# EAGLE schematic torqueControllerPWM (EAGLE 9.4.1)
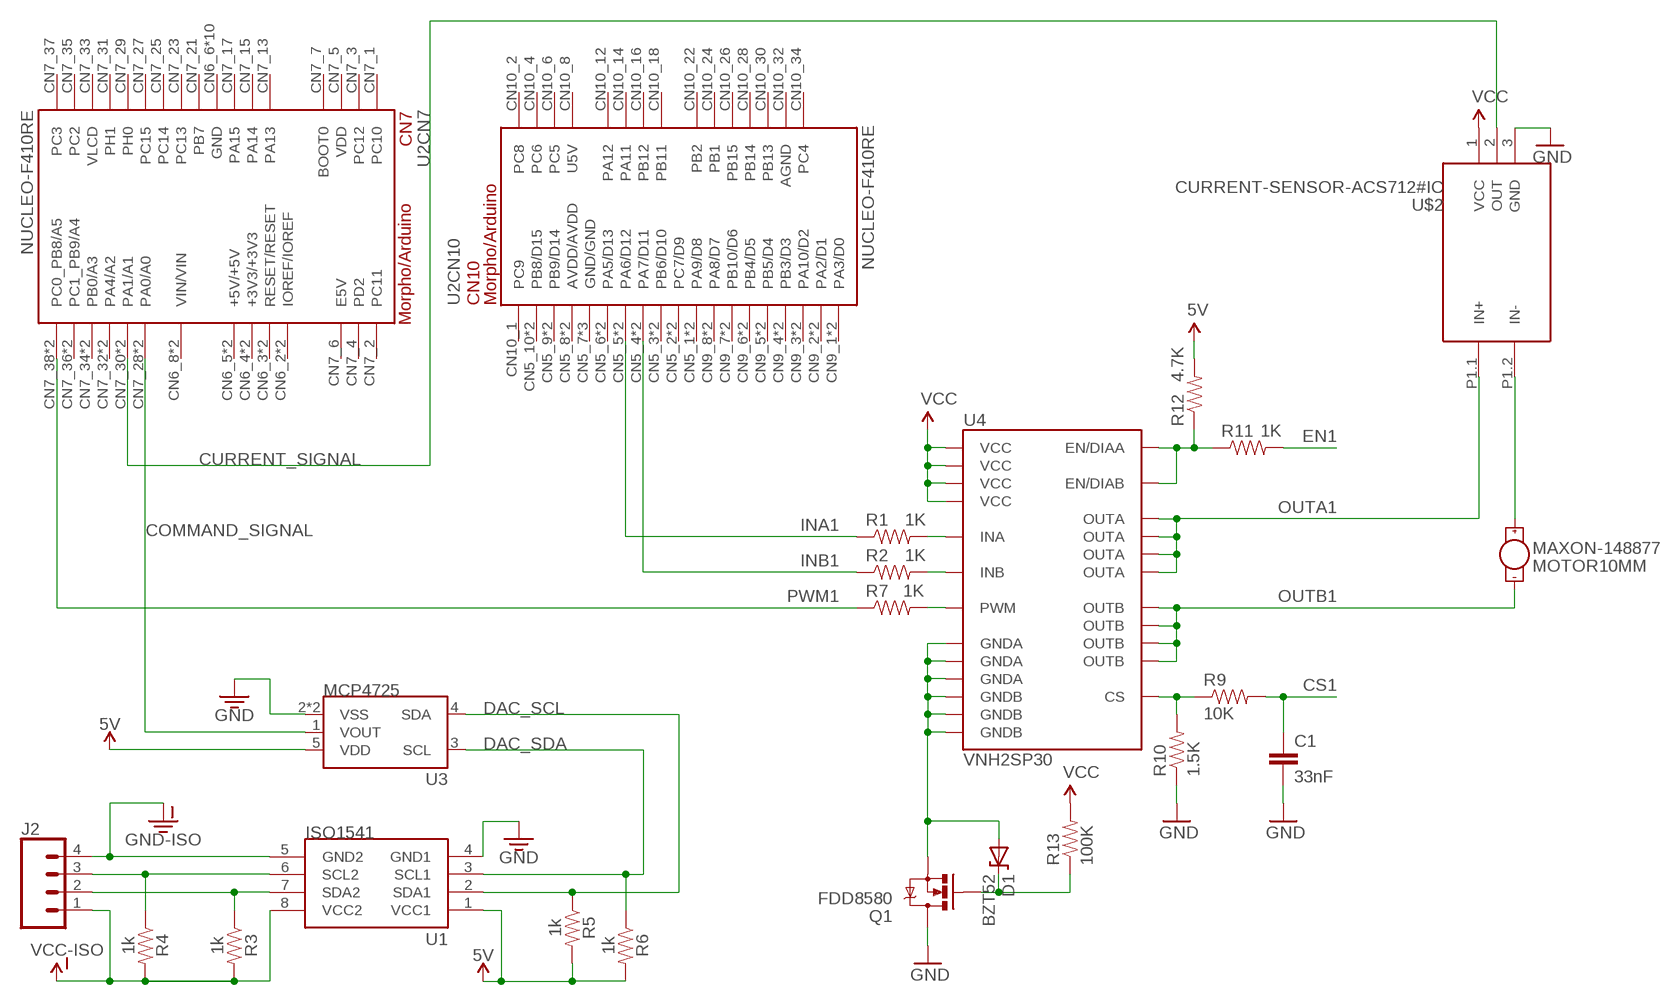
[diagram p0: schematic, sheet 1]

## Parts
C1  33nF  CAP0402-CAP  [0402-CAP]
D1  BZT52  DIODE-ZENER-BZT52  [SOD-323]
J2  CONN_04LONGPADS  [1X04_LONGPADS]
MAXON-148877  MOTOR10MM  [VIBE-MOTOR-10MM]
Q1  FDD8580  MOSFET-NCHANNELFDD8580  [DPAK]
R1  1K  RESISTOR0402-RES  [0402-RES]
R2  1K  RESISTOR0402-RES  [0402-RES]
R3  1k  RESISTOR1206  [1206]
R4  1k  RESISTOR1206  [1206]
R5  1k  RESISTOR1206  [1206]
R6  1k  RESISTOR1206  [1206]
R7  1K  RESISTOR0402-RES  [0402-RES]
R9  10K  RESISTOR0402-RES  [0402-RES]
R10  1.5K  RESISTOR0402-RES  [0402-RES]
R11  1K  RESISTOR0402-RES  [0402-RES]
R12  4.7K  RESISTOR0402-RES  [0402-RES]
R13  100K  RESISTOR0402-RES  [0402-RES]
U1  ISO1541  [DIP254P762X508-8]
U2  NUCLEO-F410RE  [MODULE_NUCLEO-L053R8]
U3  MCP4725  [1X06_LONGPADS]
U4  VNH2SP30  [VNH2SP30]
U$2  CURRENT-SENSOR-ACS712#IC  [CURRENT-SENSOR-ACS712#IC]

## Nets
3.3V: U3.2(VSS) U3.6(VSS) ; supply symbol labelled GND
5V: R5.2 R6.2 R12.2 U1.1(VCC1) U3.5(VDD)
COMMAND_SIGNAL: U2.CN7_28(CN7:PA0/A0) U2.CN8_1(CN7:PA0/A0) U3.1(VOUT)
CS1: C1.1 R9.2
CURRENT_SIGNAL: U2.CN7_30(CN7:PA1/A1) U2.CN8_2(CN7:PA1/A1) U$2.2(OUT)
DAC_SCL: R6.1 U1.3(SCL1) U3.3(SCL)
DAC_SDA: R5.1 U1.2(SDA1) U3.4(SDA)
EN1: R11.2
GND: C1.2 Q1.4(D) R10.1 U1.4(GND1) U$2.3(GND)
GND-ISO: J2.4 U1.5(GND2)
INA1: R1.1 U2.CN5_5(CN10:PA6/D12) U2.CN10_13(CN10:PA6/D12)
INB1: R2.1 U2.CN5_4(CN10:PA7/D11) U2.CN10_15(CN10:PA7/D11)
N$1: R2.2 U4.11(INB)
N$2: R1.2 U4.5(INA)
N$3: J2.2 R3.1 U1.7(SDA2)
N$4: J2.3 R4.1 U1.6(SCL2)
N$5: R7.2 U4.8(PWM)
N$7: R9.1 R10.2 U4.9(CS)
N$8: MAXON-148877.+ U$2.P1.2(IN-)
N$10: D1.2(A) Q1.3(S) U4.18(GNDB) U4.19(GNDB) U4.20(GNDB) U4.26(GNDA) U4.27(GNDA) U4.28(GNDA)
N$12: R11.1 R12.1 U4.6(EN/DIAA) U4.10(EN/DIAB)
N$13: D1.1(C) Q1.1(G) R13.1
OUTA1: U4.1(OUTA) U4.25(OUTA) U4.30(OUTA) U4.SLUG3(OUTA) U$2.P1.1(IN+)
OUTB1: MAXON-148877.- U4.15(OUTB) U4.16(OUTB) U4.21(OUTB) U4.SLUG2(OUTB)
PWM1: R7.1 U2.CN7_38(CN7:PC0_PB8/A5) U2.CN8_6(CN7:PC0_PB8/A5)
VCC: R13.2 U4.3(VCC) U4.13(VCC) U4.23(VCC) U4.SLUG1(VCC) U$2.1(VCC)
VCC-ISO: J2.1 R3.2 R4.2 U1.8(VCC2)
Unconnected: U2.CN5_1(CN10:PA9/D8) U2.CN5_2(CN10:PC7/D9) U2.CN5_3(CN10:PB6/D10) U2.CN5_6(CN10:PA5/D13) U2.CN5_7(CN10:GND/GND) U2.CN5_8(CN10:AVDD/AVDD) U2.CN5_9(CN10:PB9/D14) U2.CN5_10(CN10:PB8/D15) U2.CN6_2(CN7:IOREF/IOREF) U2.CN6_3(CN7:RESET/RESET) U2.CN6_4(CN7:+3V3/+3V3) U2.CN6_5(CN7:+5V/+5V) U2.CN6_6(CN7:GND) U2.CN6_7(CN7:GND) U2.CN6_8(CN7:VIN/VIN) U2.CN7_1(CN7:PC10) U2.CN7_2(CN7:PC11) U2.CN7_3(CN7:PC12) U2.CN7_4(CN7:PD2) U2.CN7_5(CN7:VDD) U2.CN7_6(CN7:E5V) U2.CN7_7(CN7:BOOT0) U2.CN7_8(CN7:GND) U2.CN7_12(CN7:IOREF/IOREF) U2.CN7_13(CN7:PA13) U2.CN7_14(CN7:RESET/RESET) U2.CN7_15(CN7:PA14) U2.CN7_16(CN7:+3V3/+3V3) U2.CN7_17(CN7:PA15) U2.CN7_18(CN7:+5V/+5V) U2.CN7_19(CN7:GND) U2.CN7_20(CN7:GND) U2.CN7_21(CN7:PB7) U2.CN7_22(CN7:GND) U2.CN7_23(CN7:PC13) U2.CN7_24(CN7:VIN/VIN) U2.CN7_25(CN7:PC14) U2.CN7_27(CN7:PC15) U2.CN7_29(CN7:PH0) U2.CN7_31(CN7:PH1) U2.CN7_32(CN7:PA4/A2) U2.CN7_33(CN7:VLCD) U2.CN7_34(CN7:PB0/A3) U2.CN7_35(CN7:PC2) U2.CN7_36(CN7:PC1_PB9/A4) U2.CN7_37(CN7:PC3) U2.CN8_3(CN7:PA4/A2) U2.CN8_4(CN7:PB0/A3) U2.CN8_5(CN7:PC1_PB9/A4) U2.CN9_1(CN10:PA3/D0) U2.CN9_2(CN10:PA2/D1) U2.CN9_3(CN10:PA10/D2) U2.CN9_4(CN10:PB3/D3) U2.CN9_5(CN10:PB5/D4) U2.CN9_6(CN10:PB4/D5) U2.CN9_7(CN10:PB10/D6) U2.CN9_8(CN10:PA8/D7) U2.CN10_1(CN10:PC9) U2.CN10_2(CN10:PC8) U2.CN10_3(CN10:PB8/D15) U2.CN10_4(CN10:PC6) U2.CN10_5(CN10:PB9/D14) U2.CN10_6(CN10:PC5) U2.CN10_7(CN10:AVDD/AVDD) U2.CN10_8(CN10:U5V) U2.CN10_9(CN10:GND/GND) U2.CN10_11(CN10:PA5/D13) U2.CN10_12(CN10:PA12) U2.CN10_14(CN10:PA11) U2.CN10_16(CN10:PB12) U2.CN10_17(CN10:PB6/D10) U2.CN10_18(CN10:PB11) U2.CN10_19(CN10:PC7/D9) U2.CN10_20(CN10:GND/GND) U2.CN10_21(CN10:PA9/D8) U2.CN10_22(CN10:PB2) U2.CN10_23(CN10:PA8/D7) U2.CN10_24(CN10:PB1) U2.CN10_25(CN10:PB10/D6) U2.CN10_26(CN10:PB15) U2.CN10_27(CN10:PB4/D5) U2.CN10_28(CN10:PB14) U2.CN10_29(CN10:PB5/D4) U2.CN10_30(CN10:PB13) U2.CN10_31(CN10:PB3/D3) U2.CN10_32(CN10:AGND) U2.CN10_33(CN10:PA10/D2) U2.CN10_34(CN10:PC4) U2.CN10_35(CN10:PA2/D1) U2.CN10_37(CN10:PA3/D0) U2.CN11_1(CN7:GND) U2.CN11_2(CN7:GND) U2.CN12_1(CN7:GND) U2.CN12_2(CN7:GND)

## Library data of the parts
C1 = SparkFun:CAP: Capacitor Standard 0603 ceramic capacitor, and 0.1" leaded capacitor.
D1 = SparkFun:DIODE-ZENER: Zener Diode Production Part - 8199 3.4V Zener Voltage
J2 = SparkFun-Connectors:CONN_04: Multi connection point. Often used as Generic Header-pin footprint for 0.1 inch spaced/style header connections On any of the 0.1 inch spaced packages, you can populate with these: Break Away Headers - Straight <https://www.sparkfun.com/products/116> (PRT-00116) Break Away Male Headers - Right Angle <https://www.sparkfun.com/products/553> (PRT-00553) Female Headers <https://www.sparkfun.com/products/115> (PRT-00115) Break Away Headers - Machine Pin <https://www.sparkfun.com/products/117> (PRT-00117) Break Away Female Headers - Swiss Machine Pin <https://www.sparkfun.com/products/743> (PRT-00743) For SCREWTERMINALS and SPRING TERMINALS visit here: Screw Terimnals on SparkFun.com <https://www.sparkfun.com/search/results?term=Screw+Terminals> (5mm/3.5mm/2.54mm spacing) This device is also useful as a general connection point to wire up your design to another part of your project. Our various solder wires solder well into these plated through hole pads. Hook-Up Wire - Assortment (Stranded, 22 AWG) <https://www.sparkfun.com/products/11375> (PRT-11375) Hook-Up Wire - Assortment (Solid Core, 22 AWG) <https://www.sparkfun.com/products/11367> (PRT-11367) View the entire wire category on our website here <https://www.sparkfun.com/categories/141> Special notes: Molex polarized connector foot print use with SKU : PRT-08231 with associated crimp pins and housings. 1MM SMD Version SKU: PRT-10208; PROD_ID: CONN-09696
MAXON-148877 = SparkFun-Electromechanical:MOTOR: Motor (Single-Phase) Two-terminal, single-phase motors. SparkFun Products Vibration Motor <https://www.sparkfun.com/products/8449> (ROB-08449) Physical dimension and wire connections for this powerful vibration motor. Motor has a self adhesive backing.; PROD_ID: COMP-08572; SF_SKU: ROB-08449
Q1 = SparkFun:MOSFET-NCHANNEL
R1 R2 R7 R9-R13 = SparkFun:RESISTOR: Resistor Basic schematic elements and footprints for 0603, 1206, and PTH 1/10th watt (small) resistors.
R3-R6 = SparkFun-Resistors:RESISTOR: Generic Resistor Package
U1 = OPA:ISO1541
U2 = NUCLEO-L053R8:NUCLEO-F410RE: STM32 Nucleo-64 development board with STM32L053R8T6 MCU, supports Arduino and ST morpho connectivity; AVAILABILITY: Unavailable; DESCRIPTION: STM32 Nucleo-64 development board with STM32L053R8T6 MCU, supports Arduino and ST morpho connectivity; MF: STMicroelectronics; MP: NUCLEO-L053R8; PACKAGE: None; PRICE: None
U3 = OPA:MCP4725: MCP4725 DAC
U4 = SparkFun:VNH2SP30
U$2 = acs712:CURRENT-SENSOR-ACS712#IC: Isolated Bipolar Current Sensors based on ACS712 chip Symbol with input pins More details available here: http://embedded-lab.com/blog/a-brief-overview-of-allegro-acs712-current-sensor-part-1/ Click here to find device on ebay.com <http://www.ebay.com/sch/acs712+module> Note: There are many available versions with different pinout. Please check before use